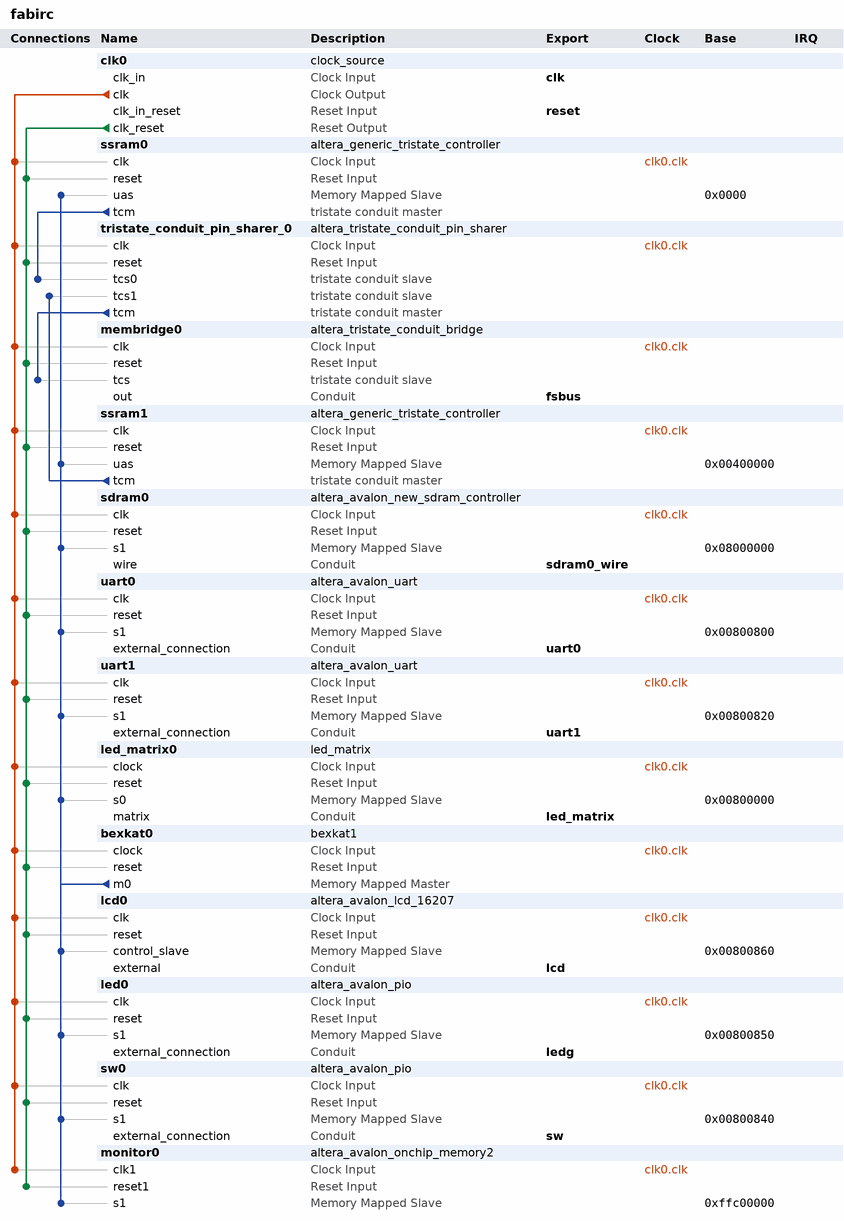
[diagram p0: system contents]
# Platform Designer (Qsys) system fabirc, Cyclone IV GX EP4CGX150DF31C7
# Parameters at their usual value, and those the tool derives, are not listed.
package require -exact qsys 14.0
create_system fabirc
set_project_property DEVICE_FAMILY {Cyclone IV GX}
set_project_property DEVICE EP4CGX150DF31C7

add_instance clk0 clock_source 14.0
set_instance_parameter_value clk0 clockFrequency 50000000

add_instance ssram0 altera_generic_tristate_controller 14.0
set_instance_parameter_value ssram0 TCM_ADDRESS_W 22
set_instance_parameter_value ssram0 TCM_DATA_W 32
set_instance_parameter_value ssram0 TCM_BYTEENABLE_W 4
set_instance_parameter_value ssram0 TCM_READ_WAIT 1
set_instance_parameter_value ssram0 TCM_WRITE_WAIT 1
set_instance_parameter_value ssram0 TCM_SETUP_WAIT 0
set_instance_parameter_value ssram0 TCM_DATA_HOLD 0
set_instance_parameter_value ssram0 TCM_MAX_PENDING_READ_TRANSACTIONS 5
set_instance_parameter_value ssram0 TCM_TURNAROUND_TIME 2
set_instance_parameter_value ssram0 TCM_TIMING_UNITS 1
set_instance_parameter_value ssram0 TCM_READLATENCY 4
set_instance_parameter_value ssram0 TCM_SYMBOLS_PER_WORD 4
set_instance_parameter_value ssram0 USE_READ 0
set_instance_parameter_value ssram0 USE_BEGINTRANSFER 1
set_instance_parameter_value ssram0 USE_BYTEENABLE 1
set_instance_parameter_value ssram0 USE_OUTPUTENABLE 1
set_instance_parameter_value ssram0 ACTIVE_LOW_READ 0
set_instance_parameter_value ssram0 ACTIVE_LOW_BYTEENABLE 1
set_instance_parameter_value ssram0 ACTIVE_LOW_OUTPUTENABLE 1
set_instance_parameter_value ssram0 ACTIVE_LOW_BEGINTRANSFER 1
set_instance_parameter_value ssram0 CHIPSELECT_THROUGH_READLATENCY 1
set_instance_parameter_value ssram0 MODULE_ASSIGNMENT_KEYS embeddedsw.configuration.hwClassnameDriverSupportList,embeddedsw.CMacro.SRAM_MEMORY_SIZE,embeddedsw.CMacro.SRAM_MEMORY_UNITS,embeddedsw.CMacro.SSRAM_DATA_WIDTH,embeddedsw.CMacro.SSRAM_READ_LATENCY,embeddedsw.memoryInfo.MEM_INIT_DATA_WIDTH,embeddedsw.memoryInfo.HAS_BYTE_LANE,embeddedsw.memoryInfo.GENERATE_DAT_SYM,embeddedsw.memoryInfo.DAT_SYM_INSTALL_DIR
set_instance_parameter_value ssram0 MODULE_ASSIGNMENT_VALUES altera_avalon_lan91c111:altera_avalon_cfi_flash,2,524288,32,2,32,1,1,SIM_DIR
set_instance_parameter_value ssram0 INTERFACE_ASSIGNMENT_KEYS embeddedsw.configuration.isMemoryDevice
set_instance_parameter_value ssram0 INTERFACE_ASSIGNMENT_VALUES 1

add_instance tristate_conduit_pin_sharer_0 altera_tristate_conduit_pin_sharer 14.0
set_instance_parameter_value tristate_conduit_pin_sharer_0 NUM_INTERFACES 2
set_instance_parameter_value tristate_conduit_pin_sharer_0 MODULE_ORIGIN_LIST ssram1.tcm,ssram1.tcm,ssram1.tcm,ssram1.tcm,ssram1.tcm,ssram1.tcm,ssram1.tcm,ssram0.tcm,ssram0.tcm,ssram0.tcm,ssram0.tcm,ssram0.tcm,ssram0.tcm,ssram0.tcm
set_instance_parameter_value tristate_conduit_pin_sharer_0 SIGNAL_ORIGIN_LIST address,outputenable_n,byteenable_n,begintransfer_n,write_n,data,chipselect_n,address,outputenable_n,byteenable_n,begintransfer_n,write_n,data,chipselect_n
set_instance_parameter_value tristate_conduit_pin_sharer_0 SHARED_SIGNAL_LIST address,ssram_oe_n,ssram_be_n,ssram_adsp_n,ssram_we_n,data,ssram1_ce_n,address,ssram_oe_n,ssram_be_n,ssram_adsp_n,ssram_we_n,data,ssram0_ce_n

add_instance membridge0 altera_tristate_conduit_bridge 14.0

add_instance ssram1 altera_generic_tristate_controller 14.0
set_instance_parameter_value ssram1 TCM_ADDRESS_W 22
set_instance_parameter_value ssram1 TCM_DATA_W 32
set_instance_parameter_value ssram1 TCM_BYTEENABLE_W 4
set_instance_parameter_value ssram1 TCM_READ_WAIT 1
set_instance_parameter_value ssram1 TCM_WRITE_WAIT 1
set_instance_parameter_value ssram1 TCM_SETUP_WAIT 0
set_instance_parameter_value ssram1 TCM_DATA_HOLD 0
set_instance_parameter_value ssram1 TCM_MAX_PENDING_READ_TRANSACTIONS 5
set_instance_parameter_value ssram1 TCM_TURNAROUND_TIME 2
set_instance_parameter_value ssram1 TCM_TIMING_UNITS 1
set_instance_parameter_value ssram1 TCM_READLATENCY 4
set_instance_parameter_value ssram1 TCM_SYMBOLS_PER_WORD 4
set_instance_parameter_value ssram1 USE_READ 0
set_instance_parameter_value ssram1 USE_BEGINTRANSFER 1
set_instance_parameter_value ssram1 USE_BYTEENABLE 1
set_instance_parameter_value ssram1 USE_OUTPUTENABLE 1
set_instance_parameter_value ssram1 ACTIVE_LOW_READ 0
set_instance_parameter_value ssram1 ACTIVE_LOW_BYTEENABLE 1
set_instance_parameter_value ssram1 ACTIVE_LOW_OUTPUTENABLE 1
set_instance_parameter_value ssram1 ACTIVE_LOW_BEGINTRANSFER 1
set_instance_parameter_value ssram1 CHIPSELECT_THROUGH_READLATENCY 1
set_instance_parameter_value ssram1 MODULE_ASSIGNMENT_KEYS embeddedsw.configuration.hwClassnameDriverSupportList,embeddedsw.CMacro.SRAM_MEMORY_SIZE,embeddedsw.CMacro.SRAM_MEMORY_UNITS,embeddedsw.CMacro.SSRAM_DATA_WIDTH,embeddedsw.CMacro.SSRAM_READ_LATENCY,embeddedsw.memoryInfo.MEM_INIT_DATA_WIDTH,embeddedsw.memoryInfo.HAS_BYTE_LANE,embeddedsw.memoryInfo.GENERATE_DAT_SYM,embeddedsw.memoryInfo.DAT_SYM_INSTALL_DIR
set_instance_parameter_value ssram1 MODULE_ASSIGNMENT_VALUES altera_avalon_lan91c111:altera_avalon_cfi_flash,2,524288,32,2,32,1,1,SIM_DIR
set_instance_parameter_value ssram1 INTERFACE_ASSIGNMENT_KEYS embeddedsw.configuration.isMemoryDevice
set_instance_parameter_value ssram1 INTERFACE_ASSIGNMENT_VALUES 1

add_instance sdram0 altera_avalon_new_sdram_controller 14.0
set_instance_parameter_value sdram0 TAC 5.5
set_instance_parameter_value sdram0 TRCD 20.0
set_instance_parameter_value sdram0 TRP 20.0
set_instance_parameter_value sdram0 casLatency 3
set_instance_parameter_value sdram0 columnWidth 10
set_instance_parameter_value sdram0 dataWidth 32
set_instance_parameter_value sdram0 generateSimulationModel false
set_instance_parameter_value sdram0 model single_Micron_MT48LC4M32B2_7_chip
set_instance_parameter_value sdram0 numberOfBanks 4
set_instance_parameter_value sdram0 numberOfChipSelects 1
set_instance_parameter_value sdram0 powerUpDelay 100.0
set_instance_parameter_value sdram0 refreshPeriod 15.625
set_instance_parameter_value sdram0 rowWidth 13

add_instance uart0 altera_avalon_uart 14.0
set_instance_parameter_value uart0 baud 115200
set_instance_parameter_value uart0 dataBits 8
set_instance_parameter_value uart0 fixedBaud true
set_instance_parameter_value uart0 parity NONE
set_instance_parameter_value uart0 stopBits 1

add_instance uart1 altera_avalon_uart 14.0
set_instance_parameter_value uart1 baud 9600
set_instance_parameter_value uart1 dataBits 8
set_instance_parameter_value uart1 fixedBaud true
set_instance_parameter_value uart1 parity NONE
set_instance_parameter_value uart1 stopBits 1

add_instance led_matrix0 led_matrix 1.2
set_instance_parameter_value led_matrix0 DELAY_VAL 32

add_instance bexkat0 bexkat1 1.3
set_instance_parameter_value bexkat0 big_endian 0

add_instance lcd0 altera_avalon_lcd_16207 14.0

add_instance led0 altera_avalon_pio 14.0
set_instance_parameter_value led0 direction Output
set_instance_parameter_value led0 width 8

add_instance sw0 altera_avalon_pio 14.0
set_instance_parameter_value sw0 direction Input
set_instance_parameter_value sw0 width 8

add_instance monitor0 altera_avalon_onchip_memory2 14.0
set_instance_parameter_value monitor0 allowInSystemMemoryContentEditor true
set_instance_parameter_value monitor0 dataWidth 32
set_instance_parameter_value monitor0 dualPort false
set_instance_parameter_value monitor0 initMemContent true
set_instance_parameter_value monitor0 initializationFileName /home/mstock/projects/soc/monitor/monitor.hex
set_instance_parameter_value monitor0 instanceID MON
set_instance_parameter_value monitor0 memorySize 16384
set_instance_parameter_value monitor0 useNonDefaultInitFile true
set_instance_parameter_value monitor0 writable false

# connections
add_connection clk0.clk bexkat0.clock clock
add_connection clk0.clk lcd0.clk clock
add_connection clk0.clk led0.clk clock
add_connection clk0.clk led_matrix0.clock clock
add_connection clk0.clk membridge0.clk clock
add_connection clk0.clk monitor0.clk1 clock
add_connection clk0.clk sdram0.clk clock
add_connection clk0.clk ssram0.clk clock
add_connection clk0.clk ssram1.clk clock
add_connection clk0.clk sw0.clk clock
add_connection clk0.clk tristate_conduit_pin_sharer_0.clk clock
add_connection clk0.clk uart0.clk clock
add_connection clk0.clk uart1.clk clock
add_connection clk0.clk_reset bexkat0.reset reset
add_connection clk0.clk_reset lcd0.reset reset
add_connection clk0.clk_reset led0.reset reset
add_connection clk0.clk_reset led_matrix0.reset reset
add_connection clk0.clk_reset membridge0.reset reset
add_connection clk0.clk_reset monitor0.reset1 reset
add_connection clk0.clk_reset sdram0.reset reset
add_connection clk0.clk_reset ssram0.reset reset
add_connection clk0.clk_reset ssram1.reset reset
add_connection clk0.clk_reset sw0.reset reset
add_connection clk0.clk_reset tristate_conduit_pin_sharer_0.reset reset
add_connection clk0.clk_reset uart0.reset reset
add_connection clk0.clk_reset uart1.reset reset
add_connection bexkat0.m0 lcd0.control_slave avalon
set_connection_parameter_value bexkat0.m0/lcd0.control_slave baseAddress 0x00800860
add_connection bexkat0.m0 led0.s1 avalon
set_connection_parameter_value bexkat0.m0/led0.s1 baseAddress 0x00800850
add_connection bexkat0.m0 led_matrix0.s0 avalon
set_connection_parameter_value bexkat0.m0/led_matrix0.s0 baseAddress 0x00800000
add_connection bexkat0.m0 monitor0.s1 avalon
set_connection_parameter_value bexkat0.m0/monitor0.s1 baseAddress 0xffc00000
add_connection bexkat0.m0 sdram0.s1 avalon
set_connection_parameter_value bexkat0.m0/sdram0.s1 baseAddress 0x08000000
add_connection bexkat0.m0 ssram0.uas avalon
set_connection_parameter_value bexkat0.m0/ssram0.uas baseAddress 0x0000
add_connection bexkat0.m0 ssram1.uas avalon
set_connection_parameter_value bexkat0.m0/ssram1.uas baseAddress 0x00400000
add_connection bexkat0.m0 sw0.s1 avalon
set_connection_parameter_value bexkat0.m0/sw0.s1 baseAddress 0x00800840
add_connection bexkat0.m0 uart0.s1 avalon
set_connection_parameter_value bexkat0.m0/uart0.s1 baseAddress 0x00800800
add_connection bexkat0.m0 uart1.s1 avalon
set_connection_parameter_value bexkat0.m0/uart1.s1 baseAddress 0x00800820
add_connection ssram0.tcm tristate_conduit_pin_sharer_0.tcs0 tristate_conduit
add_connection ssram1.tcm tristate_conduit_pin_sharer_0.tcs1 tristate_conduit
add_connection tristate_conduit_pin_sharer_0.tcm membridge0.tcs tristate_conduit

# exported interfaces
add_interface clk clock sink
set_interface_property clk EXPORT_OF clk0.clk_in
add_interface reset reset sink
set_interface_property reset EXPORT_OF clk0.clk_in_reset
add_interface fsbus conduit end
set_interface_property fsbus EXPORT_OF membridge0.out
add_interface sdram0_wire conduit end
set_interface_property sdram0_wire EXPORT_OF sdram0.wire
add_interface uart0 conduit end
set_interface_property uart0 EXPORT_OF uart0.external_connection
add_interface uart1 conduit end
set_interface_property uart1 EXPORT_OF uart1.external_connection
add_interface lcd conduit end
set_interface_property lcd EXPORT_OF lcd0.external
add_interface led_matrix conduit end
set_interface_property led_matrix EXPORT_OF led_matrix0.matrix
add_interface ledg conduit end
set_interface_property ledg EXPORT_OF led0.external_connection
add_interface sw conduit end
set_interface_property sw EXPORT_OF sw0.external_connection

set_interconnect_requirement {$system} qsys_mm.clockCrossingAdapter HANDSHAKE
set_interconnect_requirement {$system} qsys_mm.maxAdditionalLatency 1
set_interconnect_requirement {$system} qsys_mm.insertDefaultSlave FALSE

save_system fabirc.qsys
